# EAGLE design endstop (EAGLE 6.2)
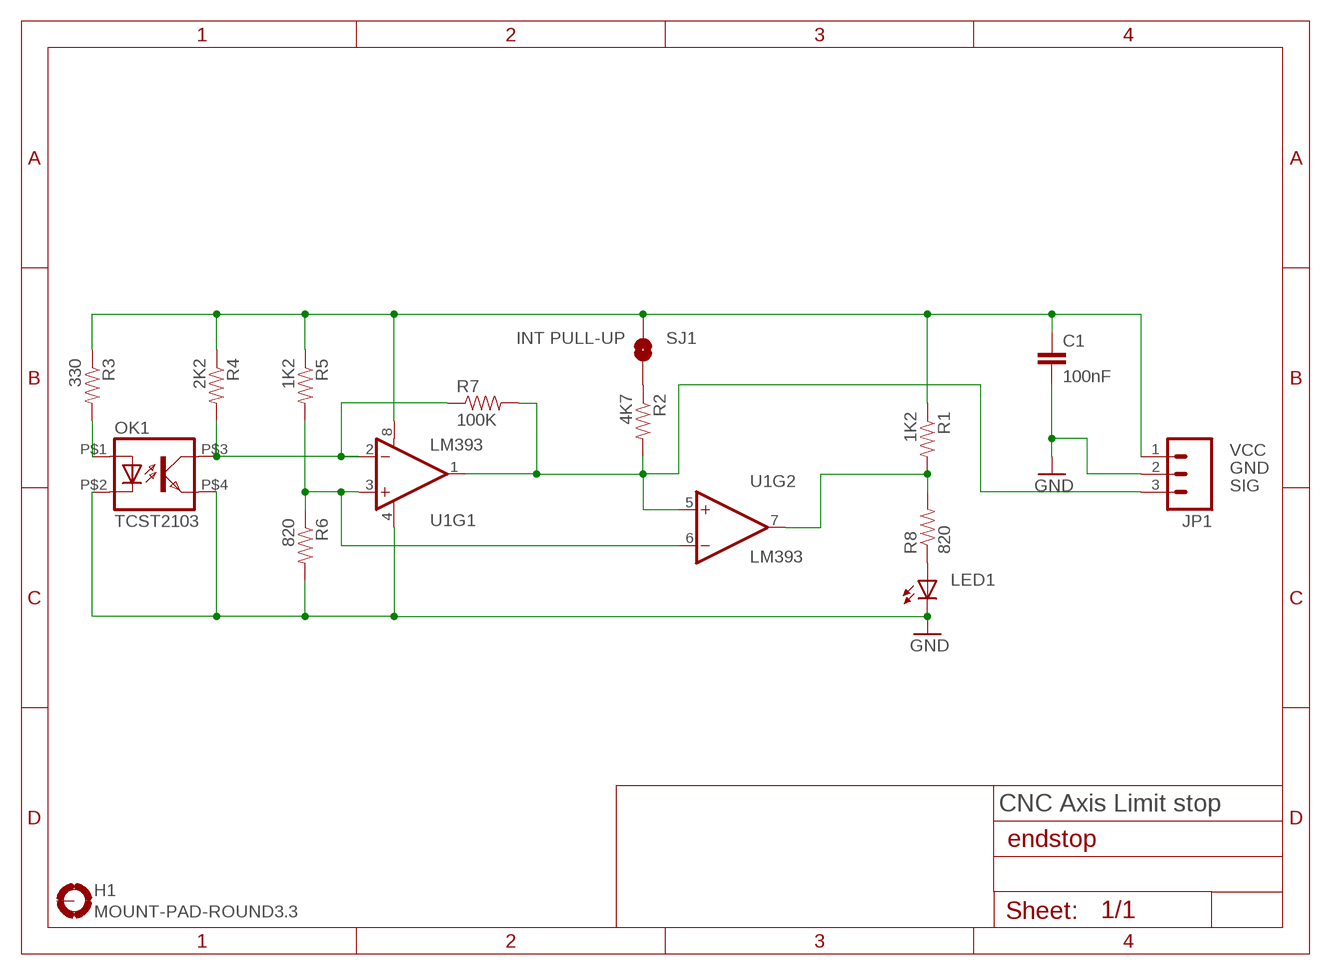
[diagram p0: schematic, sheet 1]

## Parts
C1  100nF  CAP0805  [0805]
H1  MOUNT-PAD-ROUND3.3  [3,3-PAD]
JP1  M03JST-PTH  [JST-3-PTH]
LED1  LED0603  [LED-0603]
OK1  TCST2103  [TCST2103]
R1  1K2  RESISTOR0805-RES  [0805]
R2  4K7  RESISTOR0805-RES  [0805]
R3  330  RESISTOR0805-RES  [0805]
R4  2K2  RESISTOR0805-RES  [0805]
R5  1K2  RESISTOR0805-RES  [0805]
R6  820  RESISTOR0805-RES  [0805]
R7  100K  RESISTOR0805-RES  [0805]
R8  820  RESISTOR0805-RES  [0805]
SJ1  INT PULL-UP  SOLDERJUMPERNO  [SJ_2S-NO]
U1  LM393  [SO08]

## Nets
GND: C1.2 JP1.2 LED1.C OK1.P$2(C) OK1.P$4(EMIT) R6.2 U1.4(V-)
N$1: R5.2 R6.1 U1.3(+IN) U1.6(-IN)
N$2: OK1.P$3(COL) R4.2 R7.1 U1.2(-IN)
N$4: R1.2 R8.2 U1.7(OUT)
N$5: OK1.P$1(A) R3.2
N$7: LED1.A R8.1
N$8: R2.1 SJ1.1
SIG: JP1.3 R2.2 R7.2 U1.1(OUT) U1.5(+IN)
VCC: C1.1 JP1.1 R1.1 R3.1 R4.1 R5.1 SJ1.2 U1.8(V+)
Unconnected: H1.B3,3(MOUNT)

## Notes on the sheet
- CNC Axis Limit stop

## Library data of the parts
C1 = SparkFun:CAP: Capacitor Standard 0603 ceramic capacitor, and 0.1" leaded capacitor.
H1 = holes:MOUNT-PAD-ROUND: MOUNTING PAD, round
JP1 = SparkFun:M03: Header 3 Standard 3-pin 0.1" header. Use with straight break away headers (SKU : PRT-00116), right angle break away headers (PRT-00553), swiss pins (PRT-00743), machine pins (PRT-00117), and female headers (PRT-00115). Molex polarized connector foot print use with SKU : PRT-08232 with associated crimp pins and housings.
LED1 = SparkFun:LED: LEDs Standard schematic elements and footprints for 5mm, 3mm, 1206, and 0603 sized LEDs. 5mm - Spark Fun Electronics SKU : COM-00529 (and others)
OK1 = optocoupler:TCST2103
R1-R8 = SparkFun:RESISTOR: Resistor Basic schematic elements and footprints for 0603, 1206, and PTH resistors.
SJ1 = SparkFun:SOLDERJUMPER: Solder Jumper Standard SMD solder jumper. Used to automate production. Two varients : Normally Open and Normally Closed are the same, but have different paste layers. NC will have a large amount of paste and should jumper during reflow.
U1 = SparkFun:LM393

## Board
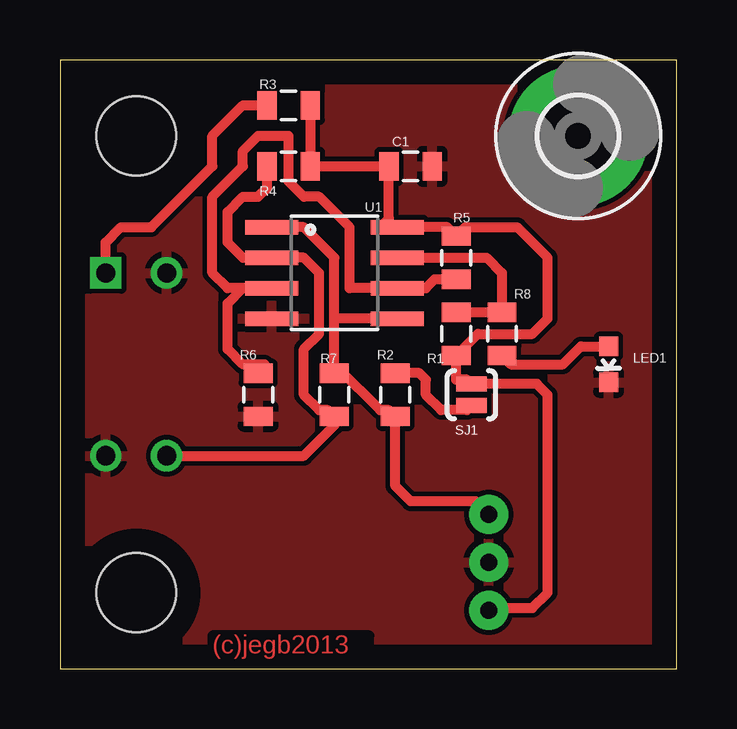
[diagram p1: board, top side]
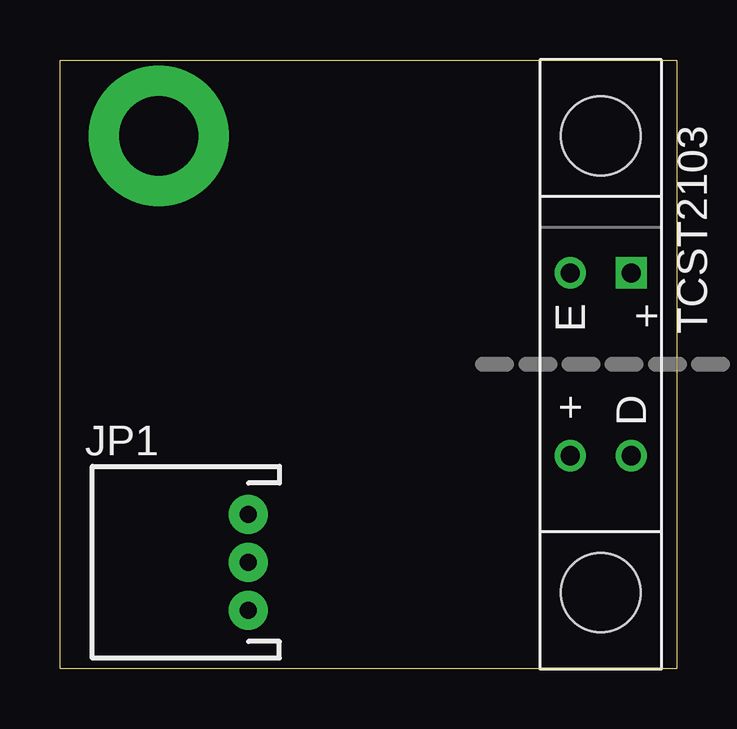
[diagram p2: board, bottom side, seen from below]

Size 25.7 x 25.39 mm. Coordinates in mm from the lower left corner, seen from the top.
Outline: 0,0 25.7,0 25.7,25.39 0,25.39 0,0
Copper layers (1*16): Top 0.035mm / dielectric 1.5mm / Bottom 0.035mm
Design rules: minimum track width 10mil, minimum drill 24mil, track to track 8mil, track to pad 8mil, pad to pad 8mil, via to via 8mil, smd to smd 8mil, copper to edge 40mil, drill to drill 8mil, minimum pad ring 10mil, minimum via ring 8mil, stop-mask expansion 4mil, vias tented up to drill 0mil, thermal gap 10mil

### Footprints (pad centres in the part's own frame; a part is rotated, then mirrored left to right if it is on the bottom)
0805 = smd 0.8 x 1.2: 1 -0.9,0; 2 0.9,0
3,3-PAD = drill 3.3 pad 5.842: B3,3 0,0
JST-3-PTH = drill 0.7 pad 1.626: 1 -2,-5; 2 0,-5; 3 2,-5
LED-0603 = smd 0.8 x 0.8: A 0,-0.75; C 0,0.75
TCST2103 = drill 0.8 square: P$1 -3.81,1.27 | drill 0.8: P$2 -3.81,-1.27; P$3 3.81,-1.27; P$4 3.81,1.27 | hole 3.3: -9.525,0; 9.525,0
SJ_2S-NO = smd 0.635 x 1.27: 1 -0.45,0; 2 0.45,0
SO08 = smd 0.61 x 2.21: 1 -1.905,-2.616; 2 -0.635,-2.616; 3 0.635,-2.616; 4 1.905,-2.616; 5 1.905,2.616; 6 0.635,2.616; 7 -0.635,2.616; 8 -1.905,2.616

### Placement (x,y rotation side)
C1  14.61,20.95 0 top
H1  21.59,22.23 0 top
JP1  22.86,4.45 90 bottom
LED1  22.86,12.7 180 top
OK1  3.17,12.7 270 bottom
R1  16.51,13.97 90 top
R2  13.97,11.43 270 top
R3  9.53,23.5 180 top
R4  9.53,20.95 180 top
R5  16.51,17.14 270 top
R6  8.26,11.43 270 top
R7  11.43,11.43 90 top
R8  18.41,13.97 90 top
SJ1  17.14,11.43 90 top
U1  11.43,16.51 270 top

### Tracks (layer width: path | path; a pad name or v marks a point on that pad's centre or on a via)
GND
  pour Top: -0.64,26.04 26.67,26.04 26.67,-0.64 -0.64,-0.64
N$1
  Top 0.406: R5.2 15.61,16.25 15.24,15.88 U1.6 12.06,15.88 12.06,18.41 10.79,19.68 10.16,19.68 9.53,20.32 9.53,22.23 8.26,22.23 7.62,21.59 7.62,20.95 6.35,19.68 6.35,16.51 6.99,15.88 U1.3 7.62,15.88 6.99,15.24 6.99,13.34 7.62,12.7 8.52,12.7 R6.1
N$2
  Top 0.406: OK1.P$3 10.16,8.89 11.43,10.16 R7.1 11.16,10.79 10.79,10.79 10.16,11.43 10.16,13.34 10.79,13.97 10.79,16.51 10.16,17.14 U1.2 7.62,17.14 6.99,17.78 6.99,19.05 7.62,19.68 8.26,19.68 8.62,20.05 R4.2
N$4
  Top 0.406: R1.2 R8.2 18.41,16.51 17.78,17.14 U1.7
N$5
  Top 0.406: R3.2 7.62,23.5 6.35,22.23 6.35,20.95 3.81,18.41 2.54,18.41 1.91,17.78 OK1.P$1
N$7
  Top 0.406: R8.1 18.79,12.7 20.95,12.7 21.7,13.45 LED1.A
N$8
  Top 0.406: 14.05,12.25 R2.1 14.97,12.33 15.24,12.06 15.24,11.43 15.88,10.79 16.96,10.79 SJ1.1
SIG
  Top 0.406: 11.43,14.61 R7.2 11.62,12.52 13.34,10.79 13.71,10.79 R2.2 13.97,7.62 14.61,6.99 17.32,6.99 JP1.3 | U1.1 10.16,18.41 11.43,17.14 11.43,14.61 | U1.5 11.43,14.61
VCC
  Top 0.406: R3.1 R4.1 C1.1 13.71,18.79 13.34,18.41 U1.8 16.14,18.41 R5.1 16.88,18.41 19.05,18.41 20.32,17.14 20.32,14.61 19.68,13.97 17.41,13.97 R1.1 16.51,12.06 16.96,12.06 SJ1.2 19.87,11.88 20.32,11.43 20.32,3.17 19.68,2.54 17.95,2.54 JP1.1

### Text on the board
Top: (c)jegb2013
tDocu: SIG | GND | VCC